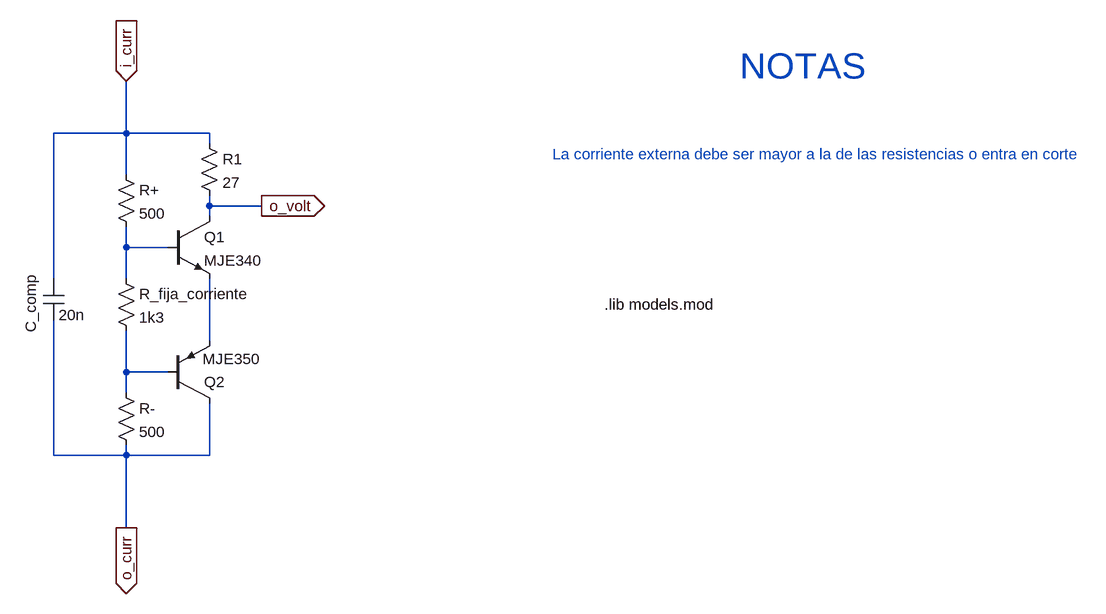
[diagram p0: schematic ss-mult-vbe-3pin.asc]
ss-mult-vbe-3pin.asc, the LTspice schematic file:
Version 4
SHEET 1 1364 680
WIRE -272 -304 -272 -384
WIRE -272 -304 -384 -304
WIRE -144 -304 -272 -304
WIRE -144 -288 -144 -304
WIRE -272 -240 -272 -304
WIRE -144 -192 -144 -208
WIRE -64 -192 -144 -192
WIRE -144 -176 -144 -192
WIRE -272 -128 -272 -160
WIRE -208 -128 -272 -128
WIRE -384 -80 -384 -304
WIRE -272 -80 -272 -128
WIRE -144 -32 -144 -80
WIRE -144 16 -144 -32
WIRE -272 64 -272 0
WIRE -208 64 -272 64
WIRE -272 96 -272 64
WIRE -384 192 -384 -16
WIRE -272 192 -272 176
WIRE -272 192 -384 192
WIRE -144 192 -144 112
WIRE -144 192 -272 192
WIRE -272 304 -272 192
FLAG -272 -384 i_curr
IOPIN -272 -384 In
FLAG -272 304 o_curr
IOPIN -272 304 Out
FLAG -64 -192 o_volt
IOPIN -64 -192 Out
DATAFLAG -272 64 "round($*1k)/1k"
DATAFLAG -272 -128 "round($*1k)/1k"
DATAFLAG -144 -32 "round($*1k)/1k"
SYMBOL npn -208 -176 R0
SYMATTR InstName Q1
SYMATTR Value MJE340
SYMBOL pnp -208 112 M180
WINDOW 0 56 33 Left 2
WINDOW 3 53 68 Left 2
SYMATTR InstName Q2
SYMATTR Value MJE350
SYMBOL res -288 -256 R0
SYMATTR InstName R+
SYMATTR Value 500
SYMBOL res -288 -96 R0
SYMATTR InstName R_fija_corriente
SYMATTR Value 1k3
SYMBOL res -288 80 R0
SYMATTR InstName R-
SYMATTR Value 500
SYMBOL cap -400 -80 R0
WINDOW 0 -19 83 VLeft 2
SYMATTR InstName C_comp
SYMATTR Value 20n
SYMBOL res -160 -304 R0
SYMATTR InstName R1
SYMATTR Value 27
TEXT 384 -272 Left 2 ;La corriente externa debe ser mayor a la de las resistencias o entra en corte
TEXT 672 -408 Left 5 ;NOTAS
TEXT 464 -40 Left 2 !.lib models.mod

The netlist it stands for:
* ss-mult-vbe-3pin.asc
Q1 o_volt N001 N002 0 MJE340
Q2 o_curr N003 N002 0 MJE350
R+ i_curr N001 500
R_fija_corriente N001 N003 1k3
R- N003 o_curr 500
C_comp i_curr o_curr 20n
R1 i_curr o_volt 27
.model NPN NPN
.model PNP PNP
.lib standard.bjt
* La corriente externa debe ser mayor a la de las resistencias o entra en corte
* NOTAS
.lib models.mod
.backanno
.end